# Altium schematic sheet eth_conn.SchDoc
size A4 portrait
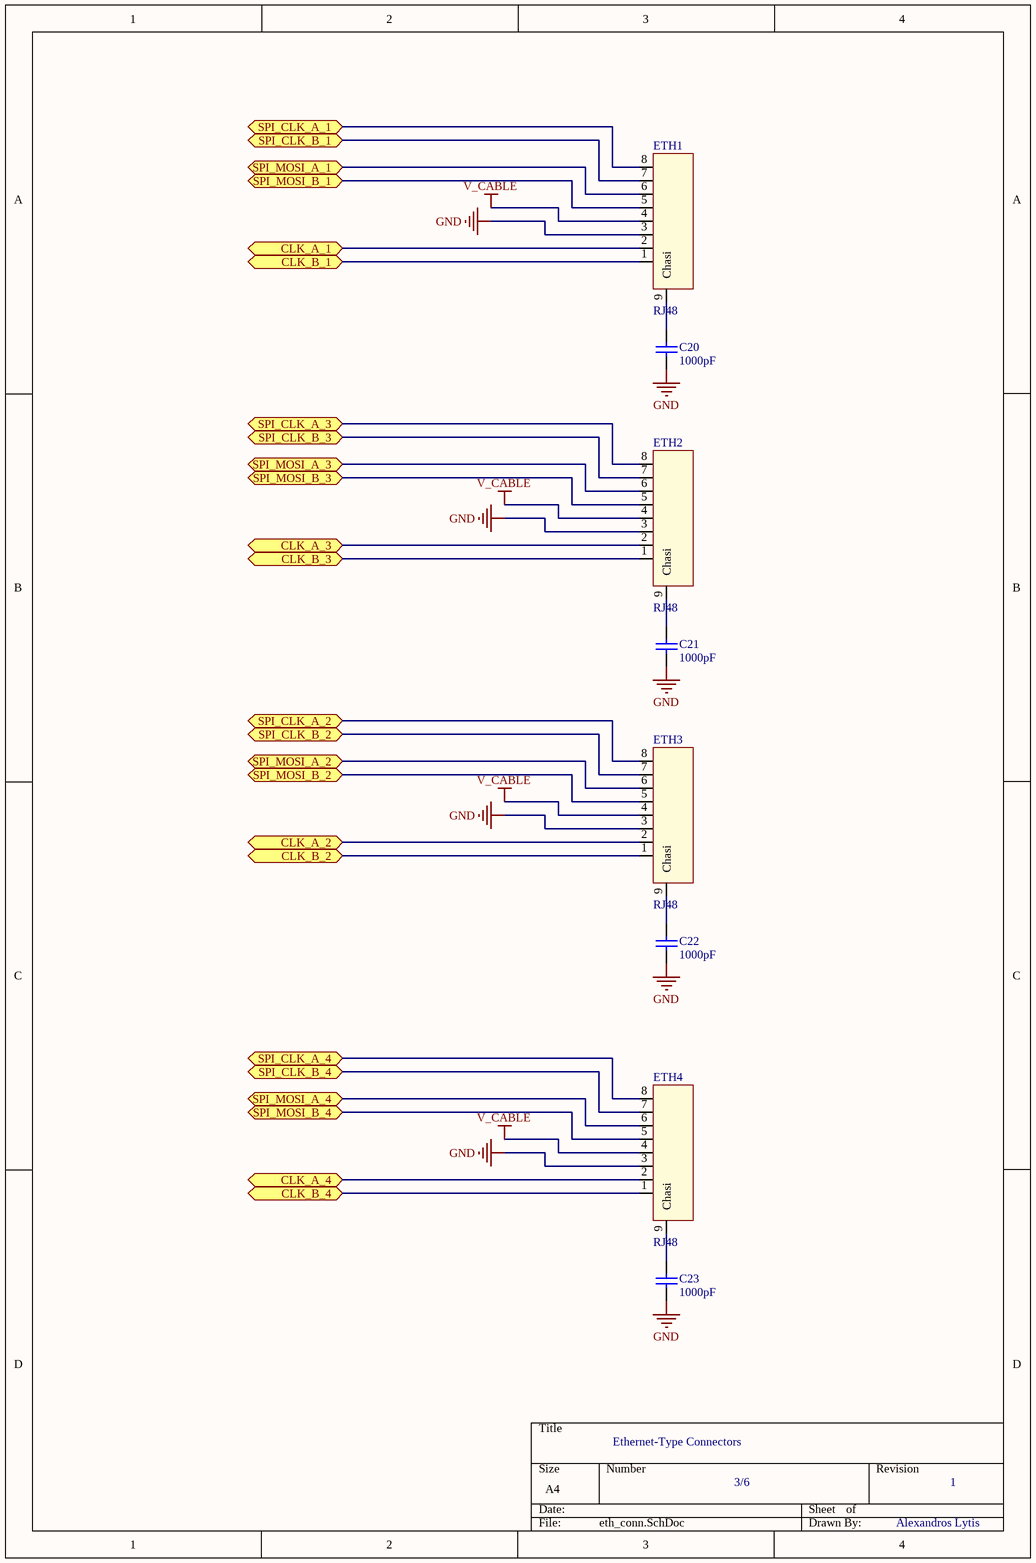
[diagram p0: eth_conn.SchDoc]

## Parts
C20  value 1000pF  [CAP0603]  (hidden comment: Cap Semi)
C21  value 1000pF  [CAP0603]  (hidden comment: Cap Semi)
C22  value 1000pF  [CAP0603]  (hidden comment: Cap Semi)
C23  value 1000pF  [CAP0603]  (hidden comment: Cap Semi)
ETH1  RJ48  [TE modular Jack RJ45]
ETH2  RJ48  [TE modular Jack RJ45]
ETH3  RJ48  [TE modular Jack RJ45]
ETH4  RJ48  [TE modular Jack RJ45]

## Ports
CLK_A_1, CLK_A_2, CLK_A_3, CLK_A_4, CLK_B_1, CLK_B_2, CLK_B_3, CLK_B_4, SPI_CLK_A_1, SPI_CLK_A_2, SPI_CLK_A_3, SPI_CLK_A_4, SPI_CLK_B_1, SPI_CLK_B_2, SPI_CLK_B_3, SPI_CLK_B_4, SPI_MOSI_A_1, SPI_MOSI_A_2, SPI_MOSI_A_3, SPI_MOSI_A_4, SPI_MOSI_B_1, SPI_MOSI_B_2, SPI_MOSI_B_3, SPI_MOSI_B_4

## Nets
GND: C20.1 C21.1 C22.1 C23.1 ETH1.3 ETH2.3 ETH3.3 ETH4.3
V_CABLE: ETH1.4 ETH2.4 ETH3.4 ETH4.4
CLK_A_1: ETH1.2 ; port CLK_A_1
CLK_A_2: ETH3.2 ; port CLK_A_2
CLK_A_3: ETH2.2 ; port CLK_A_3
CLK_A_4: ETH4.2 ; port CLK_A_4
CLK_B_1: ETH1.1 ; port CLK_B_1
CLK_B_2: ETH3.1 ; port CLK_B_2
CLK_B_3: ETH2.1 ; port CLK_B_3
CLK_B_4: ETH4.1 ; port CLK_B_4
SPI_CLK_A_1: ETH1.8 ; port SPI_CLK_A_1
SPI_CLK_A_2: ETH3.8 ; port SPI_CLK_A_2
SPI_CLK_A_3: ETH2.8 ; port SPI_CLK_A_3
SPI_CLK_A_4: ETH4.8 ; port SPI_CLK_A_4
SPI_CLK_B_1: ETH1.7 ; port SPI_CLK_B_1
SPI_CLK_B_2: ETH3.7 ; port SPI_CLK_B_2
SPI_CLK_B_3: ETH2.7 ; port SPI_CLK_B_3
SPI_CLK_B_4: ETH4.7 ; port SPI_CLK_B_4
SPI_MOSI_A_1: ETH1.6 ; port SPI_MOSI_A_1
SPI_MOSI_A_2: ETH3.6 ; port SPI_MOSI_A_2
SPI_MOSI_A_3: ETH2.6 ; port SPI_MOSI_A_3
SPI_MOSI_A_4: ETH4.6 ; port SPI_MOSI_A_4
SPI_MOSI_B_1: ETH1.5 ; port SPI_MOSI_B_1
SPI_MOSI_B_2: ETH3.5 ; port SPI_MOSI_B_2
SPI_MOSI_B_3: ETH2.5 ; port SPI_MOSI_B_3
SPI_MOSI_B_4: ETH4.5 ; port SPI_MOSI_B_4
NetC20_2: C20.2 ETH1.9(Chasi)
NetC21_2: C21.2 ETH2.9(Chasi)
NetC22_2: C22.2 ETH3.9(Chasi)
NetC23_2: C23.2 ETH4.9(Chasi)

## Notes on the sheet
- Ethernet-Type Connectors
- 3/6
- 1
- Alexandros Lytis

## Library data of the parts
C20-C23 = Cap Semi: Capacitor (Semiconductor SIM Model); Published: 8-Jun-2000; LatestRevisionDate: 29-May-2009; LatestRevisionNote: IPC-7351 Footprint Added.; PackageReference: C1206; Publisher: Altium Limited; PackageDescription: Chip Capacitor
ETH1-ETH4 = Ethernet Jack